# Altium schematic sheet CHP_DriveCab.SchDoc
size 1143 x 762 mm; SheetNumber: 1; SheetTotal: 6
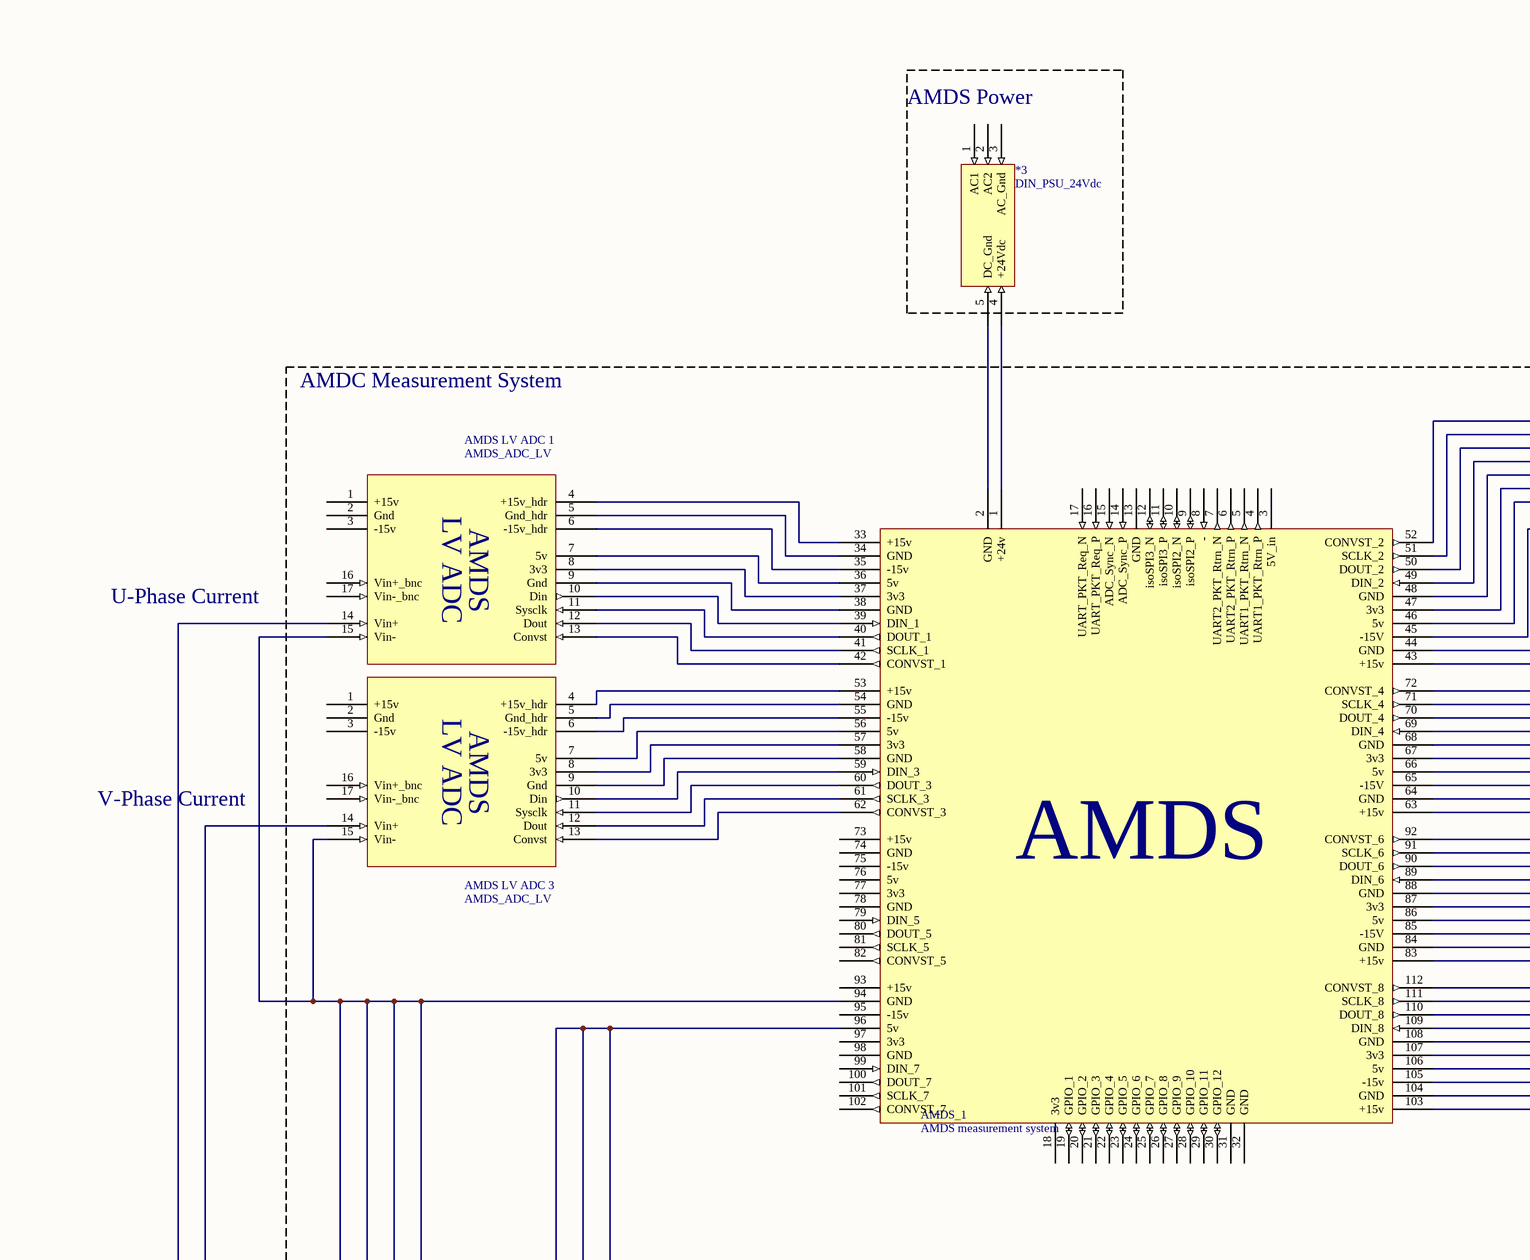
[diagram p0: CHP_DriveCab.SchDoc, top left]
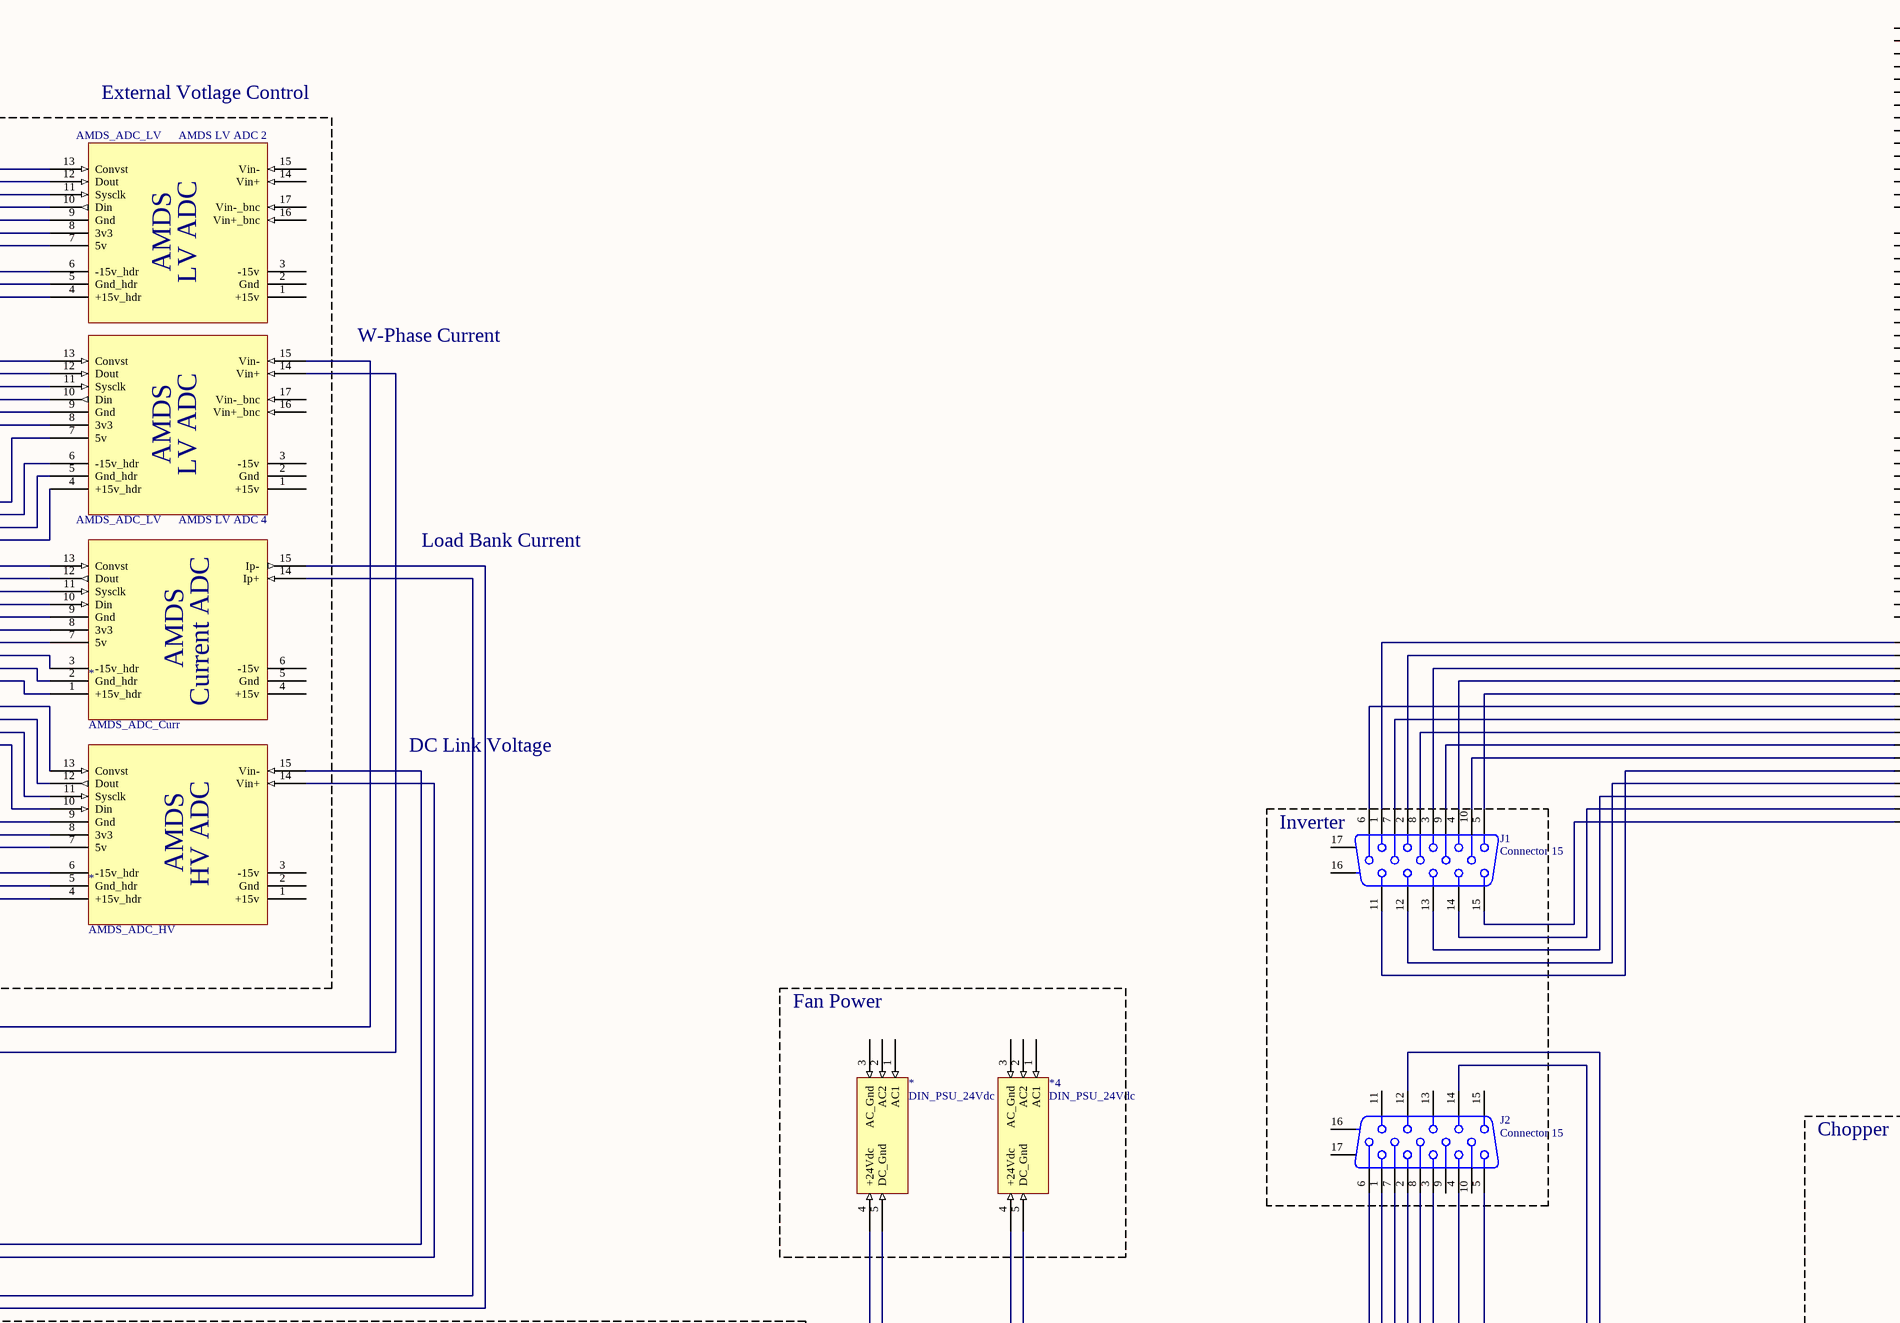
[diagram p1: CHP_DriveCab.SchDoc, top middle]
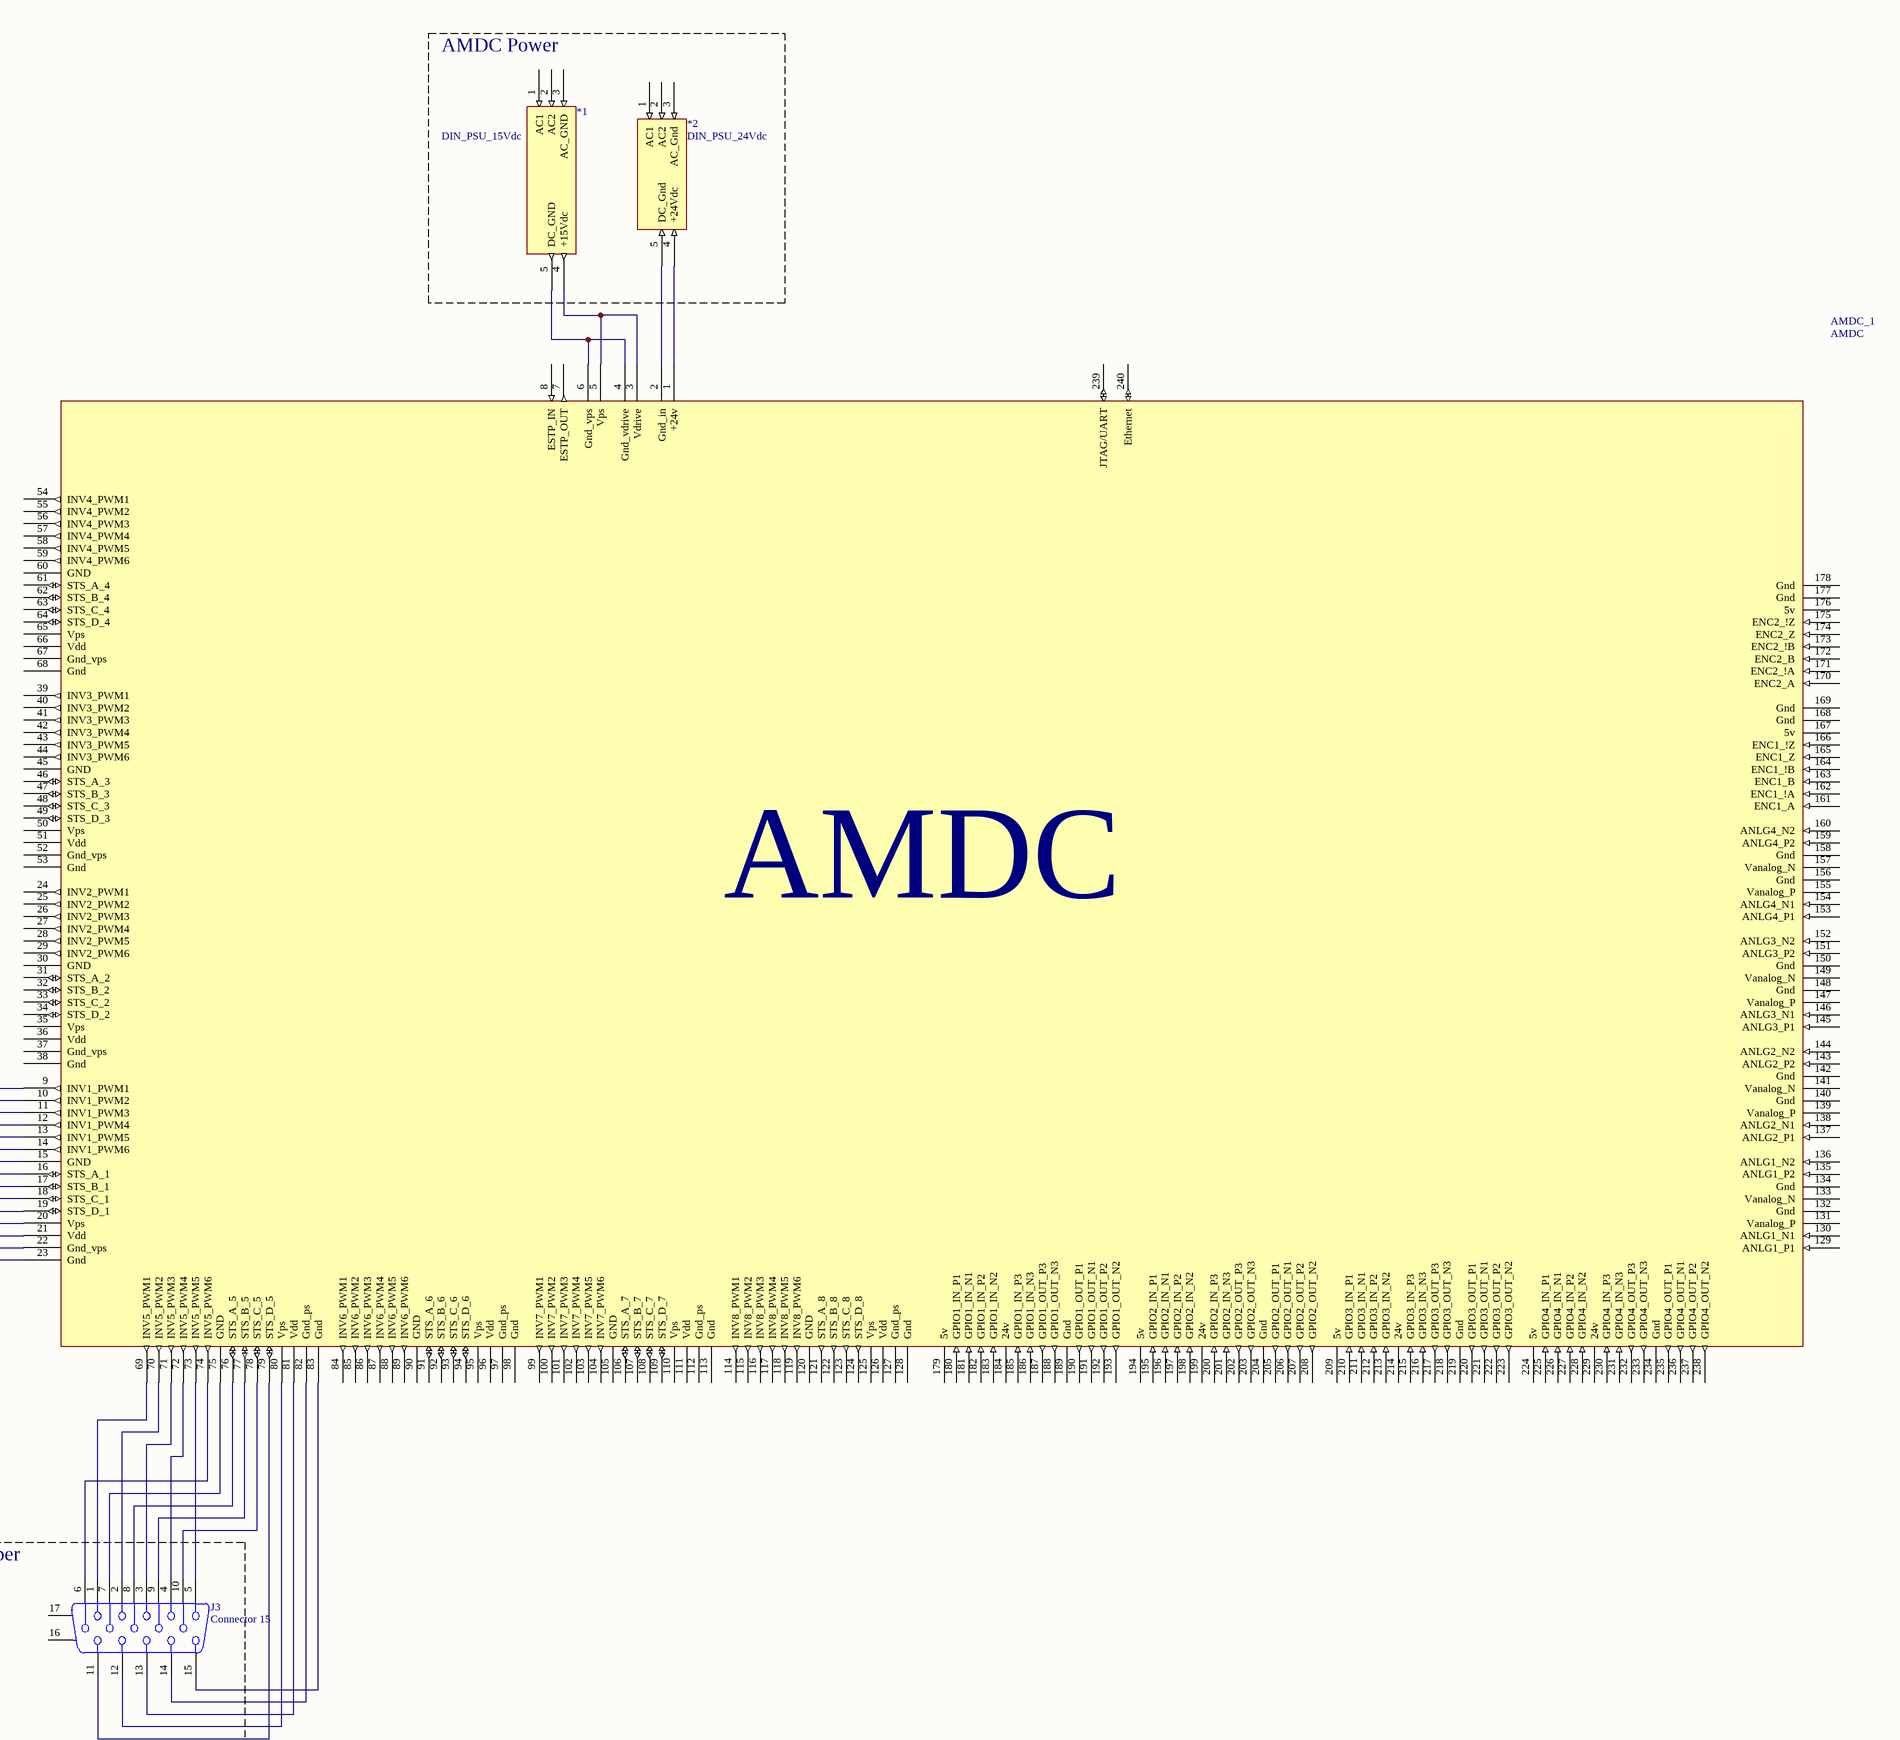
[diagram p2: CHP_DriveCab.SchDoc, top right]
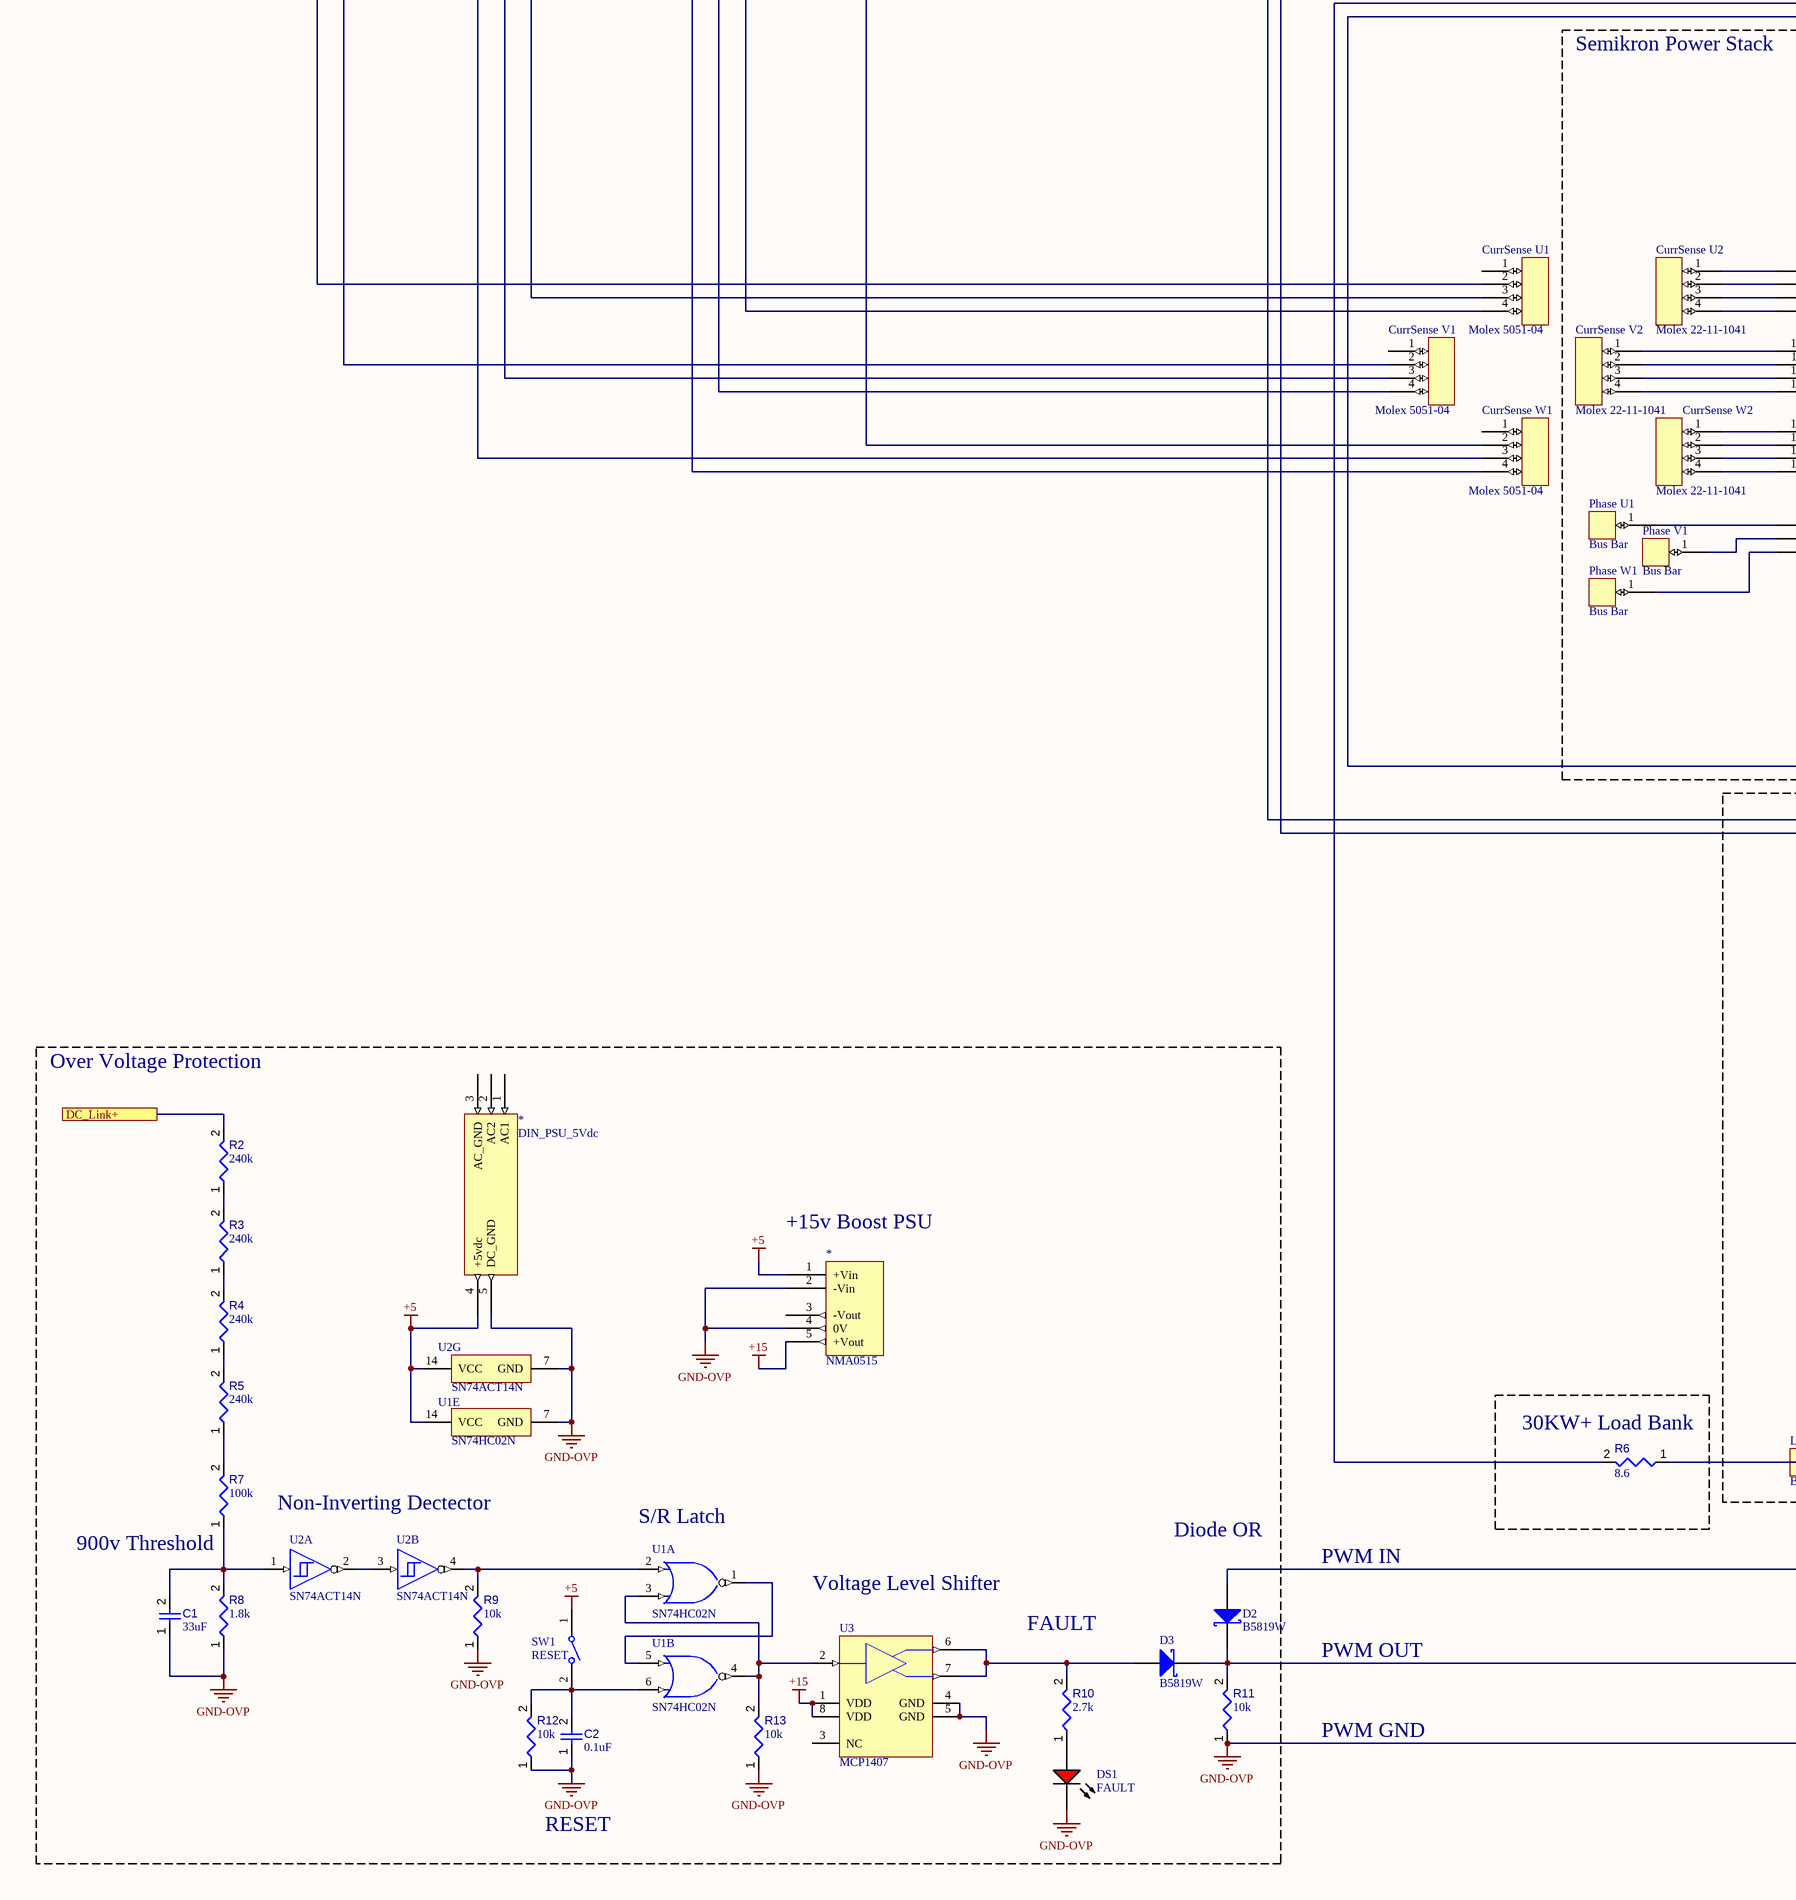
[diagram p3: CHP_DriveCab.SchDoc, bottom left]
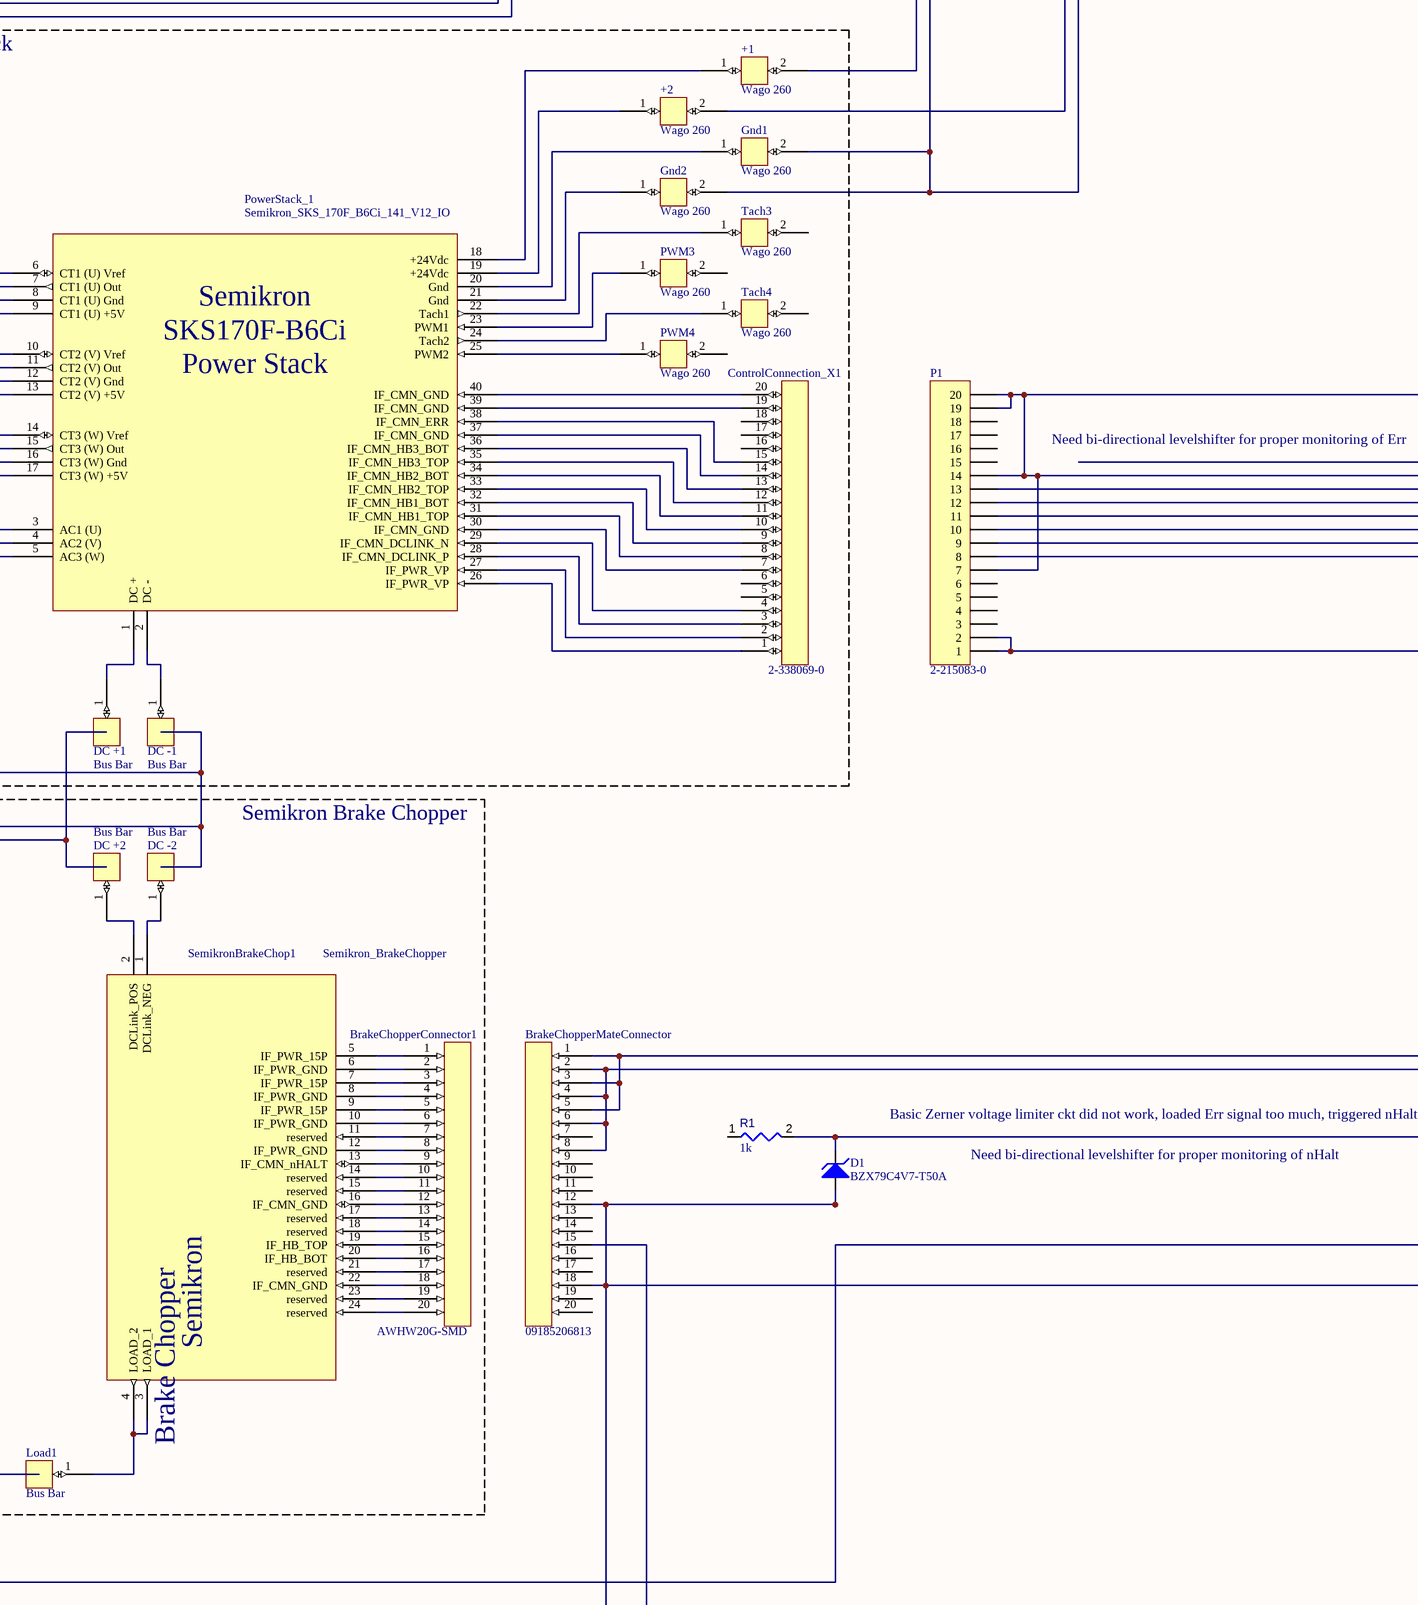
[diagram p4: CHP_DriveCab.SchDoc, bottom middle]
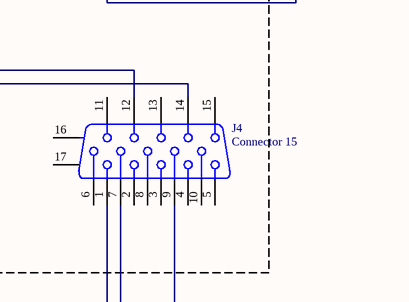
[diagram p5: CHP_DriveCab.SchDoc, bottom right]

## Parts
(Parts that share a designator on the sheet are numbered #1, #2 ... from top to bottom, then left to right.)
*1  DIN_PSU_15Vdc
*2  DIN_PSU_24Vdc
*3  DIN_PSU_24Vdc
*4  DIN_PSU_24Vdc
*#1  AMDS_ADC_Curr
*#2  AMDS_ADC_HV
*#3  DIN_PSU_24Vdc
*#4  DIN_PSU_5Vdc
*#5  NMA0515
+1  Wago 260
+2  Wago 260
AMDC_1  AMDC
AMDS_1  AMDS measurement system
AMDS_LV_ADC_1  AMDS_ADC_LV
AMDS_LV_ADC_2  AMDS_ADC_LV
AMDS_LV_ADC_3  AMDS_ADC_LV
AMDS_LV_ADC_4  AMDS_ADC_LV
BrakeChopperConnector1  AWHW20G-SMD
BrakeChopperMateConnector  09185206813
C1  value 33uF  [CAPC1608X94X35NL15T15]  (hidden comment: Capacitor 1 uF +/- 10% 16 V 0603)
C2  value 0.1uF  [CAPC1608X94X35NL15T15]  (hidden comment: Capacitor 1 uF +/- 10% 16 V 0603)
ControlConnection_X1  2-338069-0
CurrSense_U1  Molex 5051-04
CurrSense_U2  Molex 22-11-1041
CurrSense_V1  Molex 5051-04
CurrSense_V2  Molex 22-11-1041
CurrSense_W1  Molex 5051-04
CurrSense_W2  Molex 22-11-1041
D1  BZX79C4V7-T50A  [FAIR-DO-35-2]
D2  B5819W  [MCC-SOD123_V]
D3  B5819W  [MCC-SOD123_V]
DC_+1  Bus Bar
DC_+2  Bus Bar
DC_-1  Bus Bar
DC_-2  Bus Bar
DS1  FAULT  [LED-2P-2.28-3MM_A]
Gnd1  Wago 260
Gnd2  Wago 260
J1  Connector 15  [050DSUB0.762-4H15]
J2  Connector 15  [050DSUB0.762-4H15]
J3  Connector 15  [050DSUB0.762-4H15]
J4  Connector 15  [050DSUB0.762-4H15]
Load1  Bus Bar
P1  2-215083-0  [HDR1X20]
Phase_U1  Bus Bar
Phase_V1  Bus Bar
Phase_W1  Bus Bar
PowerStack_1  Semikron_SKS_170F_B6Ci_141_V12_IO
PWM3  Wago 260
PWM4  Wago 260
R1  value 1k  [RESA60-630X240]  (hidden comment: MFR-25FBF52-1K)
R2  value 240k  [RESC0805(2012)_L]  (hidden comment: 4D7R5J)
R3  value 240k  [RESC0805(2012)_L]  (hidden comment: 4D7R5J)
R4  value 240k  [RESC0805(2012)_L]  (hidden comment: 4D7R5J)
R5  value 240k  [RESC0805(2012)_L]  (hidden comment: 4D7R5J)
R6  value 8.6  [RESA60-630X240]  (hidden comment: MFR-25FBF52-100R)
R7  value 100k  [RESC0805(2012)_L]  (hidden comment: 4D7R5J)
R8  value 1.8k  [RESC0805(2012)_L]  (hidden comment: 4D7R5J)
R9  value 10k  [RESC0805(2012)_L]  (hidden comment: 4D7R5J)
R10  value 2.7k  [RESC0805(2012)_L]  (hidden comment: 4D7R5J)
R11  value 10k  [RESC0805(2012)_L]  (hidden comment: 4D7R5J)
R12  value 10k  [RESC0805(2012)_L]  (hidden comment: 4D7R5J)
R13  value 10k  [RESC0805(2012)_L]  (hidden comment: 4D7R5J)
SemikronBrakeChop1  Semikron_BrakeChopper
SW1  RESET  [OMRON-B3U-3000P_V]
Tach3  Wago 260
Tach4  Wago 260
U1  SN74HC02N  [N0014A]  (parts A,B,E of 5)
U2  SN74ACT14N  [N0014A]  (parts A,B,G of 7)
U3  MCP1407  [PDIP300-P8]

## Blocks framed on the sheet
AMDC Power: *1 *2
AMDS Power: *3
Inverter: J1 J2
Fan Power: *4 *#3
Chopper: J3 J4
Semikron Power Stack: +1 +2 ControlConnection_X1 CurrSense_U2 CurrSense_V2 CurrSense_W2 DC_+1 DC_-1 Gnd1 Gnd2 Phase_U1 Phase_V1 Phase_W1 PowerStack_1 PWM3 PWM4 Tach3 Tach4
Semikron Brake Chopper: BrakeChopperConnector1 DC_+2 DC_-2 Load1 SemikronBrakeChop1
30KW+ Load Bank: R6

## Ports
DC_Link+

## Nets
+5: *#4.4(+5vdc) *#5.1(+Vin) SW1.1 U1.14(VCC) U2.14(VCC)
+15: *#5.5(+Vout) U3.1(VDD) U3.8(VDD)
GND-OVP: *#4.5(DC_GND) *#5.2(-Vin) *#5.4(0V) BrakeChopperMateConnector.12 BrakeChopperMateConnector.18 C1.1 C2.1 D1.1(A) DS1.2(K) J4.7 R8.1 R9.1 R11.1 R12.1 R13.1 U1.7(GND) U2.7(GND) U3.4(GND) U3.5(GND)
DC_Link+: R2.2 ; port DC_Link+
Net*1_4: *1.4(+15Vdc) AMDC_1.3(Vdrive) AMDC_1.5(Vps)
Net*1_5: *1.5(DC_GND) AMDC_1.4(Gnd_vdrive) AMDC_1.6(Gnd_vps)
Net*2_4: *2.4(+24Vdc) AMDC_1.1(+24v)
Net*2_5: *2.5(DC_Gnd) AMDC_1.2(Gnd_in)
Net*3_4: *3.4(+24Vdc) AMDS_1.1(+24v)
Net*3_5: *3.5(DC_Gnd) AMDS_1.2(GND)
Net*4_4: *4.4(+24Vdc) +2.2
Net*4_5: *4.5(DC_Gnd) *#3.5(DC_Gnd) Gnd1.2 Gnd2.2
Net*#1_1: *#1.1(+15v_hdr) AMDS_1.83(+15v)
Net*#1_2: *#1.2(Gnd_hdr) AMDS_1.84(GND)
Net*#1_3: *#1.3(-15v_hdr) AMDS_1.85(-15V)
Net*#1_7: *#1.7(5v) AMDS_1.86(5v)
Net*#1_8: *#1.8(3v3) AMDS_1.87(3v3)
Net*#1_9: *#1.9(Gnd) AMDS_1.88(GND)
Net*#1_10: *#1.10(Din) AMDS_1.89(DIN_6)
Net*#1_11: *#1.11(Sysclk) AMDS_1.90(DOUT_6)
Net*#1_12: *#1.12(Dout) AMDS_1.91(SCLK_6)
Net*#1_13: *#1.13(Convst) AMDS_1.92(CONVST_6)
Net*#1_14: *#1.14(Ip+) R6.2
Net*#1_15: *#1.15(Ip-) *#2.15(Vin-)
Net*#2_4: *#2.4(+15v_hdr) AMDS_1.103(+15v)
Net*#2_5: *#2.5(Gnd_hdr) AMDS_1.104(GND)
Net*#2_6: *#2.6(-15v_hdr) AMDS_1.105(-15v)
Net*#2_7: *#2.7(5v) AMDS_1.106(5v)
Net*#2_8: *#2.8(3v3) AMDS_1.107(3v3)
Net*#2_9: *#2.9(Gnd) AMDS_1.108(GND)
Net*#2_10: *#2.10(Din) AMDS_1.109(DIN_8)
Net*#2_11: *#2.11(Sysclk) AMDS_1.110(DOUT_8)
Net*#2_12: *#2.12(Dout) AMDS_1.111(SCLK_8)
Net*#2_13: *#2.13(Convst) AMDS_1.112(CONVST_8)
Net*#3_4: *#3.4(+24Vdc) +1.2
Net+1_1: +1.1 PowerStack_1.18(+24Vdc)
Net+2_1: +2.1 PowerStack_1.19(+24Vdc)
NetAMDC_1_9: AMDC_1.9(INV1_PWM1) J1.1
NetAMDC_1_10: AMDC_1.10(INV1_PWM2) J1.2
NetAMDC_1_11: AMDC_1.11(INV1_PWM3) J1.3
NetAMDC_1_12: AMDC_1.12(INV1_PWM4) J1.4
NetAMDC_1_13: AMDC_1.13(INV1_PWM5) J1.5
NetAMDC_1_14: AMDC_1.14(INV1_PWM6) J1.6
NetAMDC_1_15: AMDC_1.15(GND) J1.7
NetAMDC_1_16: AMDC_1.16(STS_A_1) J1.8
NetAMDC_1_17: AMDC_1.17(STS_B_1) J1.9
NetAMDC_1_18: AMDC_1.18(STS_C_1) J1.10
NetAMDC_1_19: AMDC_1.19(STS_D_1) J1.11
NetAMDC_1_20: AMDC_1.20(Vps) J1.12
NetAMDC_1_21: AMDC_1.21(Vdd) J1.13
NetAMDC_1_22: AMDC_1.22(Gnd_vps) J1.14
NetAMDC_1_23: AMDC_1.23(Gnd) J1.15
NetAMDC_1_69: AMDC_1.69(INV5_PWM1) J3.1
NetAMDC_1_70: AMDC_1.70(INV5_PWM2) J3.2
NetAMDC_1_71: AMDC_1.71(INV5_PWM3) J3.3
NetAMDC_1_72: AMDC_1.72(INV5_PWM4) J3.4
NetAMDC_1_73: AMDC_1.73(INV5_PWM5) J3.5
NetAMDC_1_74: AMDC_1.74(INV5_PWM6) J3.6
NetAMDC_1_75: AMDC_1.75(GND) J3.7
NetAMDC_1_76: AMDC_1.76(STS_A_5) J3.8
NetAMDC_1_77: AMDC_1.77(STS_B_5) J3.9
NetAMDC_1_78: AMDC_1.78(STS_C_5) J3.10
NetAMDC_1_79: AMDC_1.79(STS_D_5) J3.11
NetAMDC_1_80: AMDC_1.80(Vps) J3.12
NetAMDC_1_81: AMDC_1.81(Vdd) J3.13
NetAMDC_1_82: AMDC_1.82(Gnd_ps) J3.14
NetAMDC_1_83: AMDC_1.83(Gnd) J3.15
NetAMDS_1_33: AMDS_1.33(+15v) AMDS_LV_ADC_1.4(+15v_hdr)
NetAMDS_1_34: AMDS_1.34(GND) AMDS_LV_ADC_1.5(Gnd_hdr)
NetAMDS_1_35: AMDS_1.35(-15v) AMDS_LV_ADC_1.6(-15v_hdr)
NetAMDS_1_36: AMDS_1.36(5v) AMDS_LV_ADC_1.7(5v)
NetAMDS_1_37: AMDS_1.37(3v3) AMDS_LV_ADC_1.8(3v3)
NetAMDS_1_38: AMDS_1.38(GND) AMDS_LV_ADC_1.9(Gnd)
NetAMDS_1_39: AMDS_1.39(DIN_1) AMDS_LV_ADC_1.10(Din)
NetAMDS_1_40: AMDS_1.40(DOUT_1) AMDS_LV_ADC_1.11(Sysclk)
NetAMDS_1_41: AMDS_1.41(SCLK_1) AMDS_LV_ADC_1.12(Dout)
NetAMDS_1_42: AMDS_1.42(CONVST_1) AMDS_LV_ADC_1.13(Convst)
NetAMDS_1_43: AMDS_1.43(+15v) AMDS_LV_ADC_2.4(+15v_hdr)
NetAMDS_1_44: AMDS_1.44(GND) AMDS_LV_ADC_2.5(Gnd_hdr)
NetAMDS_1_45: AMDS_1.45(-15V) AMDS_LV_ADC_2.6(-15v_hdr)
NetAMDS_1_46: AMDS_1.46(5v) AMDS_LV_ADC_2.7(5v)
NetAMDS_1_47: AMDS_1.47(3v3) AMDS_LV_ADC_2.8(3v3)
NetAMDS_1_48: AMDS_1.48(GND) AMDS_LV_ADC_2.9(Gnd)
NetAMDS_1_49: AMDS_1.49(DIN_2) AMDS_LV_ADC_2.10(Din)
NetAMDS_1_50: AMDS_1.50(DOUT_2) AMDS_LV_ADC_2.11(Sysclk)
NetAMDS_1_51: AMDS_1.51(SCLK_2) AMDS_LV_ADC_2.12(Dout)
NetAMDS_1_52: AMDS_1.52(CONVST_2) AMDS_LV_ADC_2.13(Convst)
NetAMDS_1_53: AMDS_1.53(+15v) AMDS_LV_ADC_3.4(+15v_hdr)
NetAMDS_1_54: AMDS_1.54(GND) AMDS_LV_ADC_3.5(Gnd_hdr)
NetAMDS_1_55: AMDS_1.55(-15v) AMDS_LV_ADC_3.6(-15v_hdr)
NetAMDS_1_56: AMDS_1.56(5v) AMDS_LV_ADC_3.7(5v)
NetAMDS_1_57: AMDS_1.57(3v3) AMDS_LV_ADC_3.8(3v3)
NetAMDS_1_58: AMDS_1.58(GND) AMDS_LV_ADC_3.9(Gnd)
NetAMDS_1_59: AMDS_1.59(DIN_3) AMDS_LV_ADC_3.10(Din)
NetAMDS_1_60: AMDS_1.60(DOUT_3) AMDS_LV_ADC_3.11(Sysclk)
NetAMDS_1_61: AMDS_1.61(SCLK_3) AMDS_LV_ADC_3.12(Dout)
NetAMDS_1_62: AMDS_1.62(CONVST_3) AMDS_LV_ADC_3.13(Convst)
NetAMDS_1_63: AMDS_1.63(+15v) AMDS_LV_ADC_4.4(+15v_hdr)
NetAMDS_1_64: AMDS_1.64(GND) AMDS_LV_ADC_4.5(Gnd_hdr)
NetAMDS_1_65: AMDS_1.65(-15V) AMDS_LV_ADC_4.6(-15v_hdr)
NetAMDS_1_66: AMDS_1.66(5v) AMDS_LV_ADC_4.7(5v)
NetAMDS_1_67: AMDS_1.67(3v3) AMDS_LV_ADC_4.8(3v3)
NetAMDS_1_68: AMDS_1.68(GND) AMDS_LV_ADC_4.9(Gnd)
NetAMDS_1_69: AMDS_1.69(DIN_4) AMDS_LV_ADC_4.10(Din)
NetAMDS_1_70: AMDS_1.70(DOUT_4) AMDS_LV_ADC_4.11(Sysclk)
NetAMDS_1_71: AMDS_1.71(SCLK_4) AMDS_LV_ADC_4.12(Dout)
NetAMDS_1_72: AMDS_1.72(CONVST_4) AMDS_LV_ADC_4.13(Convst)
NetAMDS_1_94: AMDS_1.94(GND) AMDS_LV_ADC_1.15(Vin-) AMDS_LV_ADC_3.15(Vin-) AMDS_LV_ADC_4.15(Vin-) CurrSense_U1.3 CurrSense_V1.3 CurrSense_W1.3
NetAMDS_1_96: AMDS_1.96(5v) CurrSense_U1.4 CurrSense_V1.4 CurrSense_W1.4
NetAMDS_LV_ADC_1_14: AMDS_LV_ADC_1.14(Vin+) CurrSense_U1.2
NetAMDS_LV_ADC_3_14: AMDS_LV_ADC_3.14(Vin+) CurrSense_V1.2
NetAMDS_LV_ADC_4_14: AMDS_LV_ADC_4.14(Vin+) CurrSense_W1.2
NetBrakeChopperConnector1_1: BrakeChopperConnector1.1 SemikronBrakeChop1.5(IF_PWR_15P)
NetBrakeChopperConnector1_2: BrakeChopperConnector1.2 SemikronBrakeChop1.6(IF_PWR_GND)
NetBrakeChopperConnector1_3: BrakeChopperConnector1.3 SemikronBrakeChop1.7(IF_PWR_15P)
NetBrakeChopperConnector1_4: BrakeChopperConnector1.4 SemikronBrakeChop1.8(IF_PWR_GND)
NetBrakeChopperConnector1_5: BrakeChopperConnector1.5 SemikronBrakeChop1.9(IF_PWR_15P)
NetBrakeChopperConnector1_6: BrakeChopperConnector1.6 SemikronBrakeChop1.10(IF_PWR_GND)
NetBrakeChopperConnector1_7: BrakeChopperConnector1.7 SemikronBrakeChop1.11(reserved)
NetBrakeChopperConnector1_8: BrakeChopperConnector1.8 SemikronBrakeChop1.12(IF_PWR_GND)
NetBrakeChopperConnector1_9: BrakeChopperConnector1.9 SemikronBrakeChop1.13(IF_CMN_nHALT)
NetBrakeChopperConnector1_10: BrakeChopperConnector1.10 SemikronBrakeChop1.14(reserved)
NetBrakeChopperConnector1_11: BrakeChopperConnector1.11 SemikronBrakeChop1.15(reserved)
NetBrakeChopperConnector1_12: BrakeChopperConnector1.12 SemikronBrakeChop1.16(IF_CMN_GND)
NetBrakeChopperConnector1_13: BrakeChopperConnector1.13 SemikronBrakeChop1.17(reserved)
NetBrakeChopperConnector1_14: BrakeChopperConnector1.14 SemikronBrakeChop1.18(reserved)
NetBrakeChopperConnector1_15: BrakeChopperConnector1.15 SemikronBrakeChop1.19(IF_HB_TOP)
NetBrakeChopperConnector1_16: BrakeChopperConnector1.16 SemikronBrakeChop1.20(IF_HB_BOT)
NetBrakeChopperConnector1_17: BrakeChopperConnector1.17 SemikronBrakeChop1.21(reserved)
NetBrakeChopperConnector1_18: BrakeChopperConnector1.18 SemikronBrakeChop1.22(IF_CMN_GND)
NetBrakeChopperConnector1_19: BrakeChopperConnector1.19 SemikronBrakeChop1.23(reserved)
NetBrakeChopperConnector1_20: BrakeChopperConnector1.20 SemikronBrakeChop1.24(reserved)
NetBrakeChopperMateConnector_1: BrakeChopperMateConnector.1 BrakeChopperMateConnector.3 BrakeChopperMateConnector.5 J4.12
NetBrakeChopperMateConnector_2: BrakeChopperMateConnector.2 BrakeChopperMateConnector.4 BrakeChopperMateConnector.6 BrakeChopperMateConnector.8 J4.14
NetBrakeChopperMateConnector_15: BrakeChopperMateConnector.15 D2.2(K) D3.2(K) R11.2
NetC1_2: C1.2 R7.1 R8.2 U2.1(1A)
NetC2_2: C2.2 R12.2 SW1.2 U1.6(2B)
NetControlConnection_X1_1: ControlConnection_X1.1 PowerStack_1.26(IF_PWR_VP)
NetControlConnection_X1_2: ControlConnection_X1.2 PowerStack_1.27(IF_PWR_VP)
NetControlConnection_X1_3: ControlConnection_X1.3 PowerStack_1.28(IF_CMN_DCLINK_P)
NetControlConnection_X1_4: ControlConnection_X1.4 PowerStack_1.29(IF_CMN_DCLINK_N)
NetControlConnection_X1_7: ControlConnection_X1.7 PowerStack_1.30(IF_CMN_GND)
NetControlConnection_X1_8: ControlConnection_X1.8 PowerStack_1.31(IF_CMN_HB1_TOP)
NetControlConnection_X1_9: ControlConnection_X1.9 PowerStack_1.32(IF_CMN_HB1_BOT)
NetControlConnection_X1_10: ControlConnection_X1.10 PowerStack_1.33(IF_CMN_HB2_TOP)
NetControlConnection_X1_11: ControlConnection_X1.11 PowerStack_1.34(IF_CMN_HB2_BOT)
NetControlConnection_X1_12: ControlConnection_X1.12 PowerStack_1.35(IF_CMN_HB3_TOP)
NetControlConnection_X1_13: ControlConnection_X1.13 PowerStack_1.36(IF_CMN_HB3_BOT)
NetControlConnection_X1_14: ControlConnection_X1.14 PowerStack_1.37(IF_CMN_GND)
NetControlConnection_X1_15: ControlConnection_X1.15 PowerStack_1.38(IF_CMN_ERR)
NetControlConnection_X1_19: ControlConnection_X1.19 PowerStack_1.39(IF_CMN_GND)
NetControlConnection_X1_20: ControlConnection_X1.20 PowerStack_1.40(IF_CMN_GND)
NetCurrSense_U2_1: CurrSense_U2.1 PowerStack_1.6(CT1_(U)_Vref)
NetCurrSense_U2_2: CurrSense_U2.2 PowerStack_1.7(CT1_(U)_Out)
NetCurrSense_U2_3: CurrSense_U2.3 PowerStack_1.8(CT1_(U)_Gnd)
NetCurrSense_U2_4: CurrSense_U2.4 PowerStack_1.9(CT1_(U)_+5V)
NetCurrSense_V2_1: CurrSense_V2.1 PowerStack_1.10(CT2_(V)_Vref)
NetCurrSense_V2_2: CurrSense_V2.2 PowerStack_1.11(CT2_(V)_Out)
NetCurrSense_V2_3: CurrSense_V2.3 PowerStack_1.12(CT2_(V)_Gnd)
NetCurrSense_V2_4: CurrSense_V2.4 PowerStack_1.13(CT2_(V)_+5V)
NetCurrSense_W2_1: CurrSense_W2.1 PowerStack_1.14(CT3_(W)_Vref)
NetCurrSense_W2_2: CurrSense_W2.2 PowerStack_1.15(CT3_(W)_Out)
NetCurrSense_W2_3: CurrSense_W2.3 PowerStack_1.16(CT3_(W)_Gnd)
NetCurrSense_W2_4: CurrSense_W2.4 PowerStack_1.17(CT3_(W)_+5V)
NetD1_2: D1.2(K) J4.9 R1.2
NetD2_1: D2.1(A) J4.1
NetD3_1: D3.1(A) R10.2 U3.6(OUT) U3.7(OUT)
NetDC_+1_1: DC_+1.1 PowerStack_1.1(DC_+)
NetDC_+2_1: DC_+2.1 SemikronBrakeChop1.2(DCLink_POS)
NetDC_-1_1: DC_-1.1 PowerStack_1.2(DC_-)
NetDC_-2_1: DC_-2.1 SemikronBrakeChop1.1(DCLink_NEG)
NetDS1_1: DS1.1(A) R10.1
NetGnd1_1: Gnd1.1 PowerStack_1.20(Gnd)
NetGnd2_1: Gnd2.1 PowerStack_1.21(Gnd)
NetJ2_1: J2.1 P1.8
NetJ2_2: J2.2 P1.9
NetJ2_3: J2.3 P1.10
NetJ2_4: J2.4 P1.11
NetJ2_5: J2.5 P1.12
NetJ2_6: J2.6 P1.13
NetJ2_7: J2.7 J2.14 P1.7 P1.14 P1.19 P1.20
NetJ2_12: J2.12 P1.1 P1.2
NetLoad1_1: Load1.1 SemikronBrakeChop1.3(LOAD_1) SemikronBrakeChop1.4(LOAD_2)
NetPhase_U1_1: Phase_U1.1 PowerStack_1.3(AC1_(U))
NetPhase_V1_1: Phase_V1.1 PowerStack_1.4(AC2_(V))
NetPhase_W1_1: Phase_W1.1 PowerStack_1.5(AC3_(W))
NetPowerStack_1_22: PowerStack_1.22(Tach1) Tach3.1
NetPowerStack_1_23: PowerStack_1.23(PWM1) PWM3.1
NetPowerStack_1_24: PowerStack_1.24(Tach2) Tach4.1
NetPowerStack_1_25: PowerStack_1.25(PWM2) PWM4.1
NetR2_1: R2.1 R3.2
NetR3_1: R3.1 R4.2
NetR4_1: R4.1 R5.2
NetR5_1: R5.1 R7.2
NetR9_2: R9.2 U1.2(1A) U2.4(~{2Y})
NetR13_2: R13.2 U1.3(1B) U1.4(2Y) U3.2(IN)
NetU1_1: U1.1(1Y) U1.5(2A)
NetU2_2: U2.2(~{1Y}) U2.3(2A)

Not connected (* = marked no-connect by the designer): *1 1(AC1) 2(AC2) 3(AC_GND); *2 1(AC1) 2(AC2) 3(AC_Gnd); *3 1(AC1) 2(AC2) 3(AC_Gnd); *4 1(AC1) 2(AC2) 3(AC_Gnd); *#1 4(+15v) 5(Gnd) 6(-15v); *#2 1(+15v) 2(Gnd) 3(-15v) 14(Vin+); *#3 1(AC1) 2(AC2) 3(AC_Gnd); *#4 1(AC1) 2(AC2) 3(AC_GND); *#5 3(-Vout); AMDC_1 7(ESTP_OUT) 8(ESTP_IN) 24(INV2_PWM1) 25(INV2_PWM2) 26(INV2_PWM3) 27(INV2_PWM4) 28(INV2_PWM5) 29(INV2_PWM6) 30(GND) 31(STS_A_2) 32(STS_B_2) 33(STS_C_2) 34(STS_D_2) 35(Vps) 36(Vdd) 37(Gnd_vps) 38(Gnd) 39(INV3_PWM1) 40(INV3_PWM2) 41(INV3_PWM3) 42(INV3_PWM4) 43(INV3_PWM5) 44(INV3_PWM6) 45(GND) 46(STS_A_3) 47(STS_B_3) 48(STS_C_3) 49(STS_D_3) 50(Vps) 51(Vdd) 52(Gnd_vps) 53(Gnd) 54(INV4_PWM1) 55(INV4_PWM2) 56(INV4_PWM3) 57(INV4_PWM4) 58(INV4_PWM5) 59(INV4_PWM6) 60(GND) 61(STS_A_4) 62(STS_B_4) 63(STS_C_4) 64(STS_D_4) 65(Vps) 66(Vdd) 67(Gnd_vps) 68(Gnd) 84(INV6_PWM1) 85(INV6_PWM2) 86(INV6_PWM3) 87(INV6_PWM4) 88(INV6_PWM5) 89(INV6_PWM6) 90(GND) 91(STS_A_6) 92(STS_B_6) 93(STS_C_6) 94(STS_D_6) 95(Vps) 96(Vdd) 97(Gnd_ps) 98(Gnd) 99(INV7_PWM1) 100(INV7_PWM2) 101(INV7_PWM3) 102(INV7_PWM4) 103(INV7_PWM5) 104(INV7_PWM6) 105(GND) 106(STS_A_7) 107(STS_B_7) 108(STS_C_7) 109(STS_D_7) 110(Vps) 111(Vdd) 112(Gnd_ps) 113(Gnd) 114(INV8_PWM1) 115(INV8_PWM2) 116(INV8_PWM3) 117(INV8_PWM4) 118(INV8_PWM5) 119(INV8_PWM6) 120(GND) 121(STS_A_8) 122(STS_B_8) 123(STS_C_8) 124(STS_D_8) 125(Vps) 126(Vdd) 127(Gnd_ps) 128(Gnd) 129(ANLG1_P1) 130(ANLG1_N1) 131(Vanalog_P) 132(Gnd) 133(Vanalog_N) 134(Gnd) 135(ANLG1_P2) 136(ANLG1_N2) 137(ANLG2_P1) 138(ANLG2_N1) 139(Vanalog_P) 140(Gnd) 141(Vanalog_N) 142(Gnd) 143(ANLG2_P2) 144(ANLG2_N2) 145(ANLG3_P1) 146(ANLG3_N1) 147(Vanalog_P) 148(Gnd) 149(Vanalog_N) 150(Gnd) 151(ANLG3_P2) 152(ANLG3_N2) 153(ANLG4_P1) 154(ANLG4_N1) 155(Vanalog_P) 156(Gnd) 157(Vanalog_N) 158(Gnd) 159(ANLG4_P2) 160(ANLG4_N2) 161(ENC1_A) 162(ENC1_!A) 163(ENC1_B) 164(ENC1_!B) 165(ENC1_Z) 166(ENC1_!Z) 167(5v) 168(Gnd) 169(Gnd) 170(ENC2_A) 171(ENC2_!A) 172(ENC2_B) 173(ENC2_!B) 174(ENC2_Z) 175(ENC2_!Z) 176(5v) 177(Gnd) 178(Gnd) 179(5v) 180(GPIO1_IN_P1) 181(GPIO1_IN_N1) 182(GPIO1_IN_P2) 183(GPIO1_IN_N2) 184(24v) 185(GPIO1_IN_P3) 186(GPIO1_IN_N3) 187(GPIO1_OUT_P3) 188(GPIO1_OUT_N3) 189(Gnd) 190(GPIO1_OUT_P1) 191(GPIO1_OUT_N1) 192(GPIO1_OUT_P2) 193(GPIO1_OUT_N2) 194(5v) 195(GPIO2_IN_P1) 196(GPIO2_IN_N1) 197(GPIO2_IN_P2) 198(GPIO2_IN_N2) 199(24v) 200(GPIO2_IN_P3) 201(GPIO2_IN_N3) 202(GPIO2_OUT_P3) 203(GPIO2_OUT_N3) 204(Gnd) 205(GPIO2_OUT_P1) 206(GPIO2_OUT_N1) 207(GPIO2_OUT_P2) 208(GPIO2_OUT_N2) 209(5v) 210(GPIO3_IN_P1) 211(GPIO3_IN_N1) 212(GPIO3_IN_P2) 213(GPIO3_IN_N2) 214(24v) 215(GPIO3_IN_P3) 216(GPIO3_IN_N3) 217(GPIO3_OUT_P3) 218(GPIO3_OUT_N3) 219(Gnd) 220(GPIO3_OUT_P1) 221(GPIO3_OUT_N1) 222(GPIO3_OUT_P2) 223(GPIO3_OUT_N2) 224(5v) 225(GPIO4_IN_P1) 226(GPIO4_IN_N1) 227(GPIO4_IN_P2) 228(GPIO4_IN_N2) 229(24v) 230(GPIO4_IN_P3) 231(GPIO4_IN_N3) 232(GPIO4_OUT_P3) 233(GPIO4_OUT_N3) 234(Gnd) 235(GPIO4_OUT_P1) 236(GPIO4_OUT_N1) 237(GPIO4_OUT_P2) 238(GPIO4_OUT_N2) 239(JTAG/UART) 240(Ethernet); AMDS_1 3(5V_in) 4(UART1_PKT_Rtrn_P) 5(UART1_PKT_Rtrn_N) 6(UART2_PKT_Rtrn_P) 7(UART2_PKT_Rtrn_N) 8(-) 9(isoSPI2_P) 10(isoSPI2_N) 11(isoSPI3_P) 12(isoSPI3_N) 13(GND) 14(ADC_Sync_P) 15(ADC_Sync_N) 16(UART_PKT_Req_P) 17(UART_PKT_Req_N) 18(3v3) 19(GPIO_1) 20(GPIO_2) 21(GPIO_3) 22(GPIO_4) 23(GPIO_5) 24(GPIO_6) 25(GPIO_7) 26(GPIO_8) 27(GPIO_9) 28(GPIO_10) 29(GPIO_11) 30(GPIO_12) 31(GND) 32(GND) 73(+15v) 74(GND) 75(-15v) 76(5v) 77(3v3) 78(GND) 79(DIN_5) 80(DOUT_5) 81(SCLK_5) 82(CONVST_5) 93(+15v) 95(-15v) 97(3v3) 98(GND) 99(DIN_7) 100(DOUT_7) 101(SCLK_7) 102(CONVST_7); AMDS_LV_ADC_1 1(+15v) 2(Gnd) 3(-15v) 16(Vin+_bnc) 17(Vin-_bnc); AMDS_LV_ADC_2 1(+15v) 2(Gnd) 3(-15v) 14(Vin+) 15(Vin-) 16(Vin+_bnc) 17(Vin-_bnc); AMDS_LV_ADC_3 1(+15v) 2(Gnd) 3(-15v) 16(Vin+_bnc) 17(Vin-_bnc); AMDS_LV_ADC_4 1(+15v) 2(Gnd) 3(-15v) 16(Vin+_bnc) 17(Vin-_bnc); BrakeChopperMateConnector 7 9 10 11 13 14 16 17 19 20; ControlConnection_X1 5 6 16 17 18; CurrSense_U1 1; CurrSense_V1 1; CurrSense_W1 1; J1 16(MH1) 17(MH2); J2 8 9 10 11 13 15 16(MH1) 17(MH2); J3 16(MH1) 17(MH2); J4 2 3 4 5 6 8 10 11 13 15 16(MH1) 17(MH2); P1 3 4 5 6 15 16 17 18; PWM3 2; PWM4 2; R1 1; R6 1; Tach3 2; Tach4 2; U3 3(NC)

## Notes on the sheet
- AMDC Measurement System
- External Votlage Control
- U-Phase Current
- W-Phase Current
- V-Phase Current
- Load Bank Current
- DC Link Voltage
- Need bi-directional levelshifter for proper monitoring of Err
- Over Voltage Protection
- Basic Zerner voltage limiter ckt did not work, loaded Err signal too much, triggered nHalt
- Need bi-directional levelshifter for proper monitoring of nHalt
- (near *#5) +15v Boost PSU
- Non-Inverting Dectector
- (near U1) S/R Latch
- Diode OR
- (near R7) 900v Threshold
- Voltage Level Shifter
- PWM IN
- FAULT
- PWM OUT
- PWM GND
- RESET
- (in symbol CMP-001-0001-4) Semikron; SKS170F-B6Ci; Power Stack
- (in symbol CMP-001-0002-4) Semikron; Brake Chopper
- (in symbol CMP-001-0003-2) AMDS
- (in symbol CMP-001-0005-4) AMDS; HV ADC
- (in symbol CMP-001-0006-5) AMDS; LV ADC
- (in symbol CMP-001-0007-5) AMDS; Current ADC

## Library data of the parts
*1 = CMP-019-00050-1: 15VDC power supply
*2-*4 *#3 = CMP-019-00049-1: 24Vdc power supply from 115Vac in
*#1 = CMP-001-0007-5: AMDS current measurement card
*#2 = CMP-001-0005-4: High voltage measurement card
*#4 = CMP-019-00052-1
*#5 = CMP-019-00053-1: Module DC-DC 5VIN 2-OUT 15V/-15V 0.033A/-0.033A 1W 5-Pin SIP Tube
+1 +2 Gnd1 Gnd2 PWM3 PWM4 Tach3 Tach4 = CMP-002-00072-3: 28-16 AWG Spring Clamp Terminal Block - DIN Mountable
AMDC_1 = CMP-001-0004-4: Advanced Motor Drive Controller
AMDS_1 = CMP-001-0003-2: AMDS measurement system to be combined with AMDC for motor control
AMDS_LV_ADC_1-AMDS_LV_ADC_4 = CMP-001-0006-5: Low Voltage measurement card
BrakeChopperConnector1 BrakeChopperMateConnector = CMP-002-00075-1: ASSMANN WSW AWHW Series, 2.54mm Pitch 20 Way 2 Row Straight PCB Header, Solder Termination, 3A
C1 C2 = CMP-001-00003-6: Chip Capacitor, 1 uF, +/- 10%, 16 V, 0603 (1608 Metric); Voltage Rating: 16V; Capacitor Type: Ceramic; Max Operating Temperature: 125°C; Pins: 2; Tolerance: 10%; Min Operating Temperature: -55°C; RoHS Compliant: True; Mounting Technology: SM; Case/Package: 0603
ControlConnection_X1 = CMP-002-00071-1: Conn FFC Connector F 20 POS 2.54mm Solder ST SMD T/R
CurrSense_U1 CurrSense_U2 CurrSense_V1 CurrSense_V2 CurrSense_W1 CurrSense_W2 = CMP-002-00073-1: Headers & Wire Housings 2.5MM VERT 4P HDR W/FRICTION RAMP AU
D1 = CMP-004-00021-2: Zener Diode, 3.6 V, 5 mA, -65 to 200 degC, 2-Pin DO-35, RoHS, Bulk; Manufacturer: Fairchild Semiconductor; Tolerance: 6%; Power: 500mW; Forward Voltage: 1.5V; Impedance: 90Ohm; Package Quantity: 1000; Min Operating Temperature: -65°C; Datasheet Version: Rev. C1, 07/2007; Max Operating Temperature: 200°C; Mounting Technology: TH; Package Description: 2-Pin Through Hole Diode, Dia 1.72 mm, Body Length 3.805 mm; RoHS Compliant: True; Manufacturer URL: https://www.fairchildsemi.com/; Package Reference: DO-35-2; Case/Package: DO-35-2; Datasheet URL: https://www.fairchildsemi.com/datasheets/BZ/BZX79C3V6.pdf; Package URL: https://www.fairchildsemi.com/package-drawings/DO/DO35A.pdf; Pins: 2; Packaging: Bulk
D2 D3 = CMP-004-00005-2: Schottky Barrier Rectifier, 40 V, 1 A, -65 to 125 degC, 2-Pin SOD123, RoHS, Tape and Reel; Manufacturer: Micro Commercial Components; Datasheet Version: Rev. B, 01/2013; RoHS Compliant: Unknown; Manufacturer URL: http://www.mccsemi.com/; Package URL: http://www.mccsemi.com/up_pdf/1N4448W(SOD-123).pdf; Case/Package: SOD123; Mounting Technology: SM; Datasheet URL: http://www.mccsemi.com/up_pdf/B5817W-B5819W(SOD-123).pdf; Package Description: 2-Pin Small Outline Diode, Body 2.7 x 1.6 mm, Height 1.35 mm; Package Reference: SOD123
DC_+1 DC_+2 DC_-1 DC_-2 Load1 Phase_U1 Phase_V1 Phase_W1 = CMP-001-0000-1: Single Connection bus bar
DS1 = CMP-007-00007-2: Red LED, 80 mW, 30 mA, -25 to 85 degC, 2-Pin THD; Manufacturer: Shenzhen CGX; Package Description: 2-Pin Through Hole Device, Dia 3 mm, Pitch 2.28 mm; Datasheet URL: http://datasheet.octopart.com/304090041-Chengguangxing-datasheet-62330656.pdf; Mounting Technology: TH; Manufacturer URL: http://szcgx.com/; RoHS Compliant: Unknown; Datasheet Version: Sep-14; Case/Package: 304090041; Package Reference: 304090041
J1-J4 = Connector 15: Receptacle Assembly, 15-Pin, Sim Line Connector; PackageDocument: B; Positions: 15; Gender: Receptacle Header; Published: 15-Jun-2001; LatestRevisionDate: 17-Jul-2002; LatestRevisionNote: Re-released for DXP Platform.; DatasheetDocument: 24-Nov-1999; PackageReference: 788574; Publisher: Altium Limited; Orientation: Right Angle
P1 = Header 20: Header, 20-Pin; LatestRevisionDate: 17-Jul-2002; LatestRevisionNote: Re-released for DXP Platform.; Publisher: Altium Limited
PowerStack_1 = CMP-001-0001-4: IO connections of Semikron power stack. Intended to route to connectors used on the power stack such that external connecting equipment can be shown in schematic form w/ appropriate mating connector.
R1 = CMP-009-00048-4: Axial Resistor, 1 KOhm, +/- 1%, 250 mW, -55 to 155 degC, 2-Pin THD, RoHS, Bulk; Manufacturer: Yageo; Voltage Rating: 250V; Power: 250mW; Min Operating Temperature: -55°C; Max Operating Temperature: 155°C; Tolerance: 1%; Package Reference: MFR-25; Composition: CarbonFilm; Mounting Technology: TH; Packaging: Bulk; Case/Package: Axial; Datasheet URL: http://www.yageo.com/documents/recent/Yageo%20LR_MFR_2013.pdf; Package Quantity: 200; Manufacturer URL: http://www.yageo.com/; Package Description: 2-Pin Axial Lead, Dia 2.4 mm, Body Length 6.3 mm; Datasheet Version: Apr-13; RoHS Compliant: True
R2-R5 R7-R13 = CMP-009-00106-2: 4R7 0.125W 5% 0805 (2012 Metric)  SMD; Power: 125mW; Mounting Technology: SMT; Pins: 2; Case/Package: 0805; Tolerance: 5%
R6 = CMP-009-00046-4: Axial Resistor, 100 Ohm, +/- 1%, 0.25 W, -55 to 155 degC, 2-Pin THD, RoHS, Bulk; Manufacturer: Yageo; Voltage Rating: 250V; Power: 250mW; Packaging: Bulk; Max Operating Temperature: 155°C; Mounting Technology: TH; Datasheet Version: Apr-13; Case/Package: Axial; RoHS Compliant: True; Package Description: 2-Pin Axial Lead, Dia 2.4 mm, Body Length 6.3 mm; Package Quantity: 200; Package Reference: MFR-25; Tolerance: 1%; Composition: CarbonFilm; Datasheet URL: http://www.yageo.com/documents/recent/Yageo%20LR_MFR_2013.pdf; Manufacturer URL: http://www.yageo.com/; Min Operating Temperature: -55°C
SemikronBrakeChop1 = CMP-001-0002-4: Integrated buck device w/ heatsink
SW1 = CMP-011-00005-2: Tactile Switch, SPST-NO, 0.05 A, 12 V, -25 to 70 degC, 2-Pin SMD, RoHS, Tape and Reel; Manufacturer: Omron Electronic Components; Operating Force: 162gf; Voltage Rating (DC): 12V; Current Rating: 50mA; IP Rating: IP40; Throw Configuration: SPST; Max Contact Resistance: 100mohm; RoHS Compliant: True; Contact Current Rating: 50mA; Manufacturer URL: http://www.omron.com/; Packaging: TapeandReel; Max Voltage Rating (DC): 12V; Contact Material: Silver; Datasheet Version: Jan-15; Package Reference: B3U-3000P; Package Description: 2-Pin Surface Mount Device, Body 4 x 3.2 mm; Min Operating Temperature: -25°C; Package Quantity: 4000; Max Operating Temperature: 70°C; Max Current Rating: 50mA; Voltage Rating: 12V; Case/Package: B3U-3000P; Mounting Technology: SM; Datasheet URL: https://www.omron.com/ecb/products/pdf/en-b3u.pdf
U1 = CMP-016-00010-1: IC Quad 2i/p NOR gate, 74HC02N DIP14 2-6V
U2 = CMP-015-00008-1: 6-ch, 4.5-V to 5.5-V inverters with Schmitt-Trigger inputs 14-PDIP -40 to 85
U3 = CMP-024-00000-1: Microchip MCP1407-E/P; MOSFET Power Driver 6A; 4.5 to 18V; Non-Inverting; 8-Pin PDIP